# EAGLE design PlusShield (EAGLE 6.2)
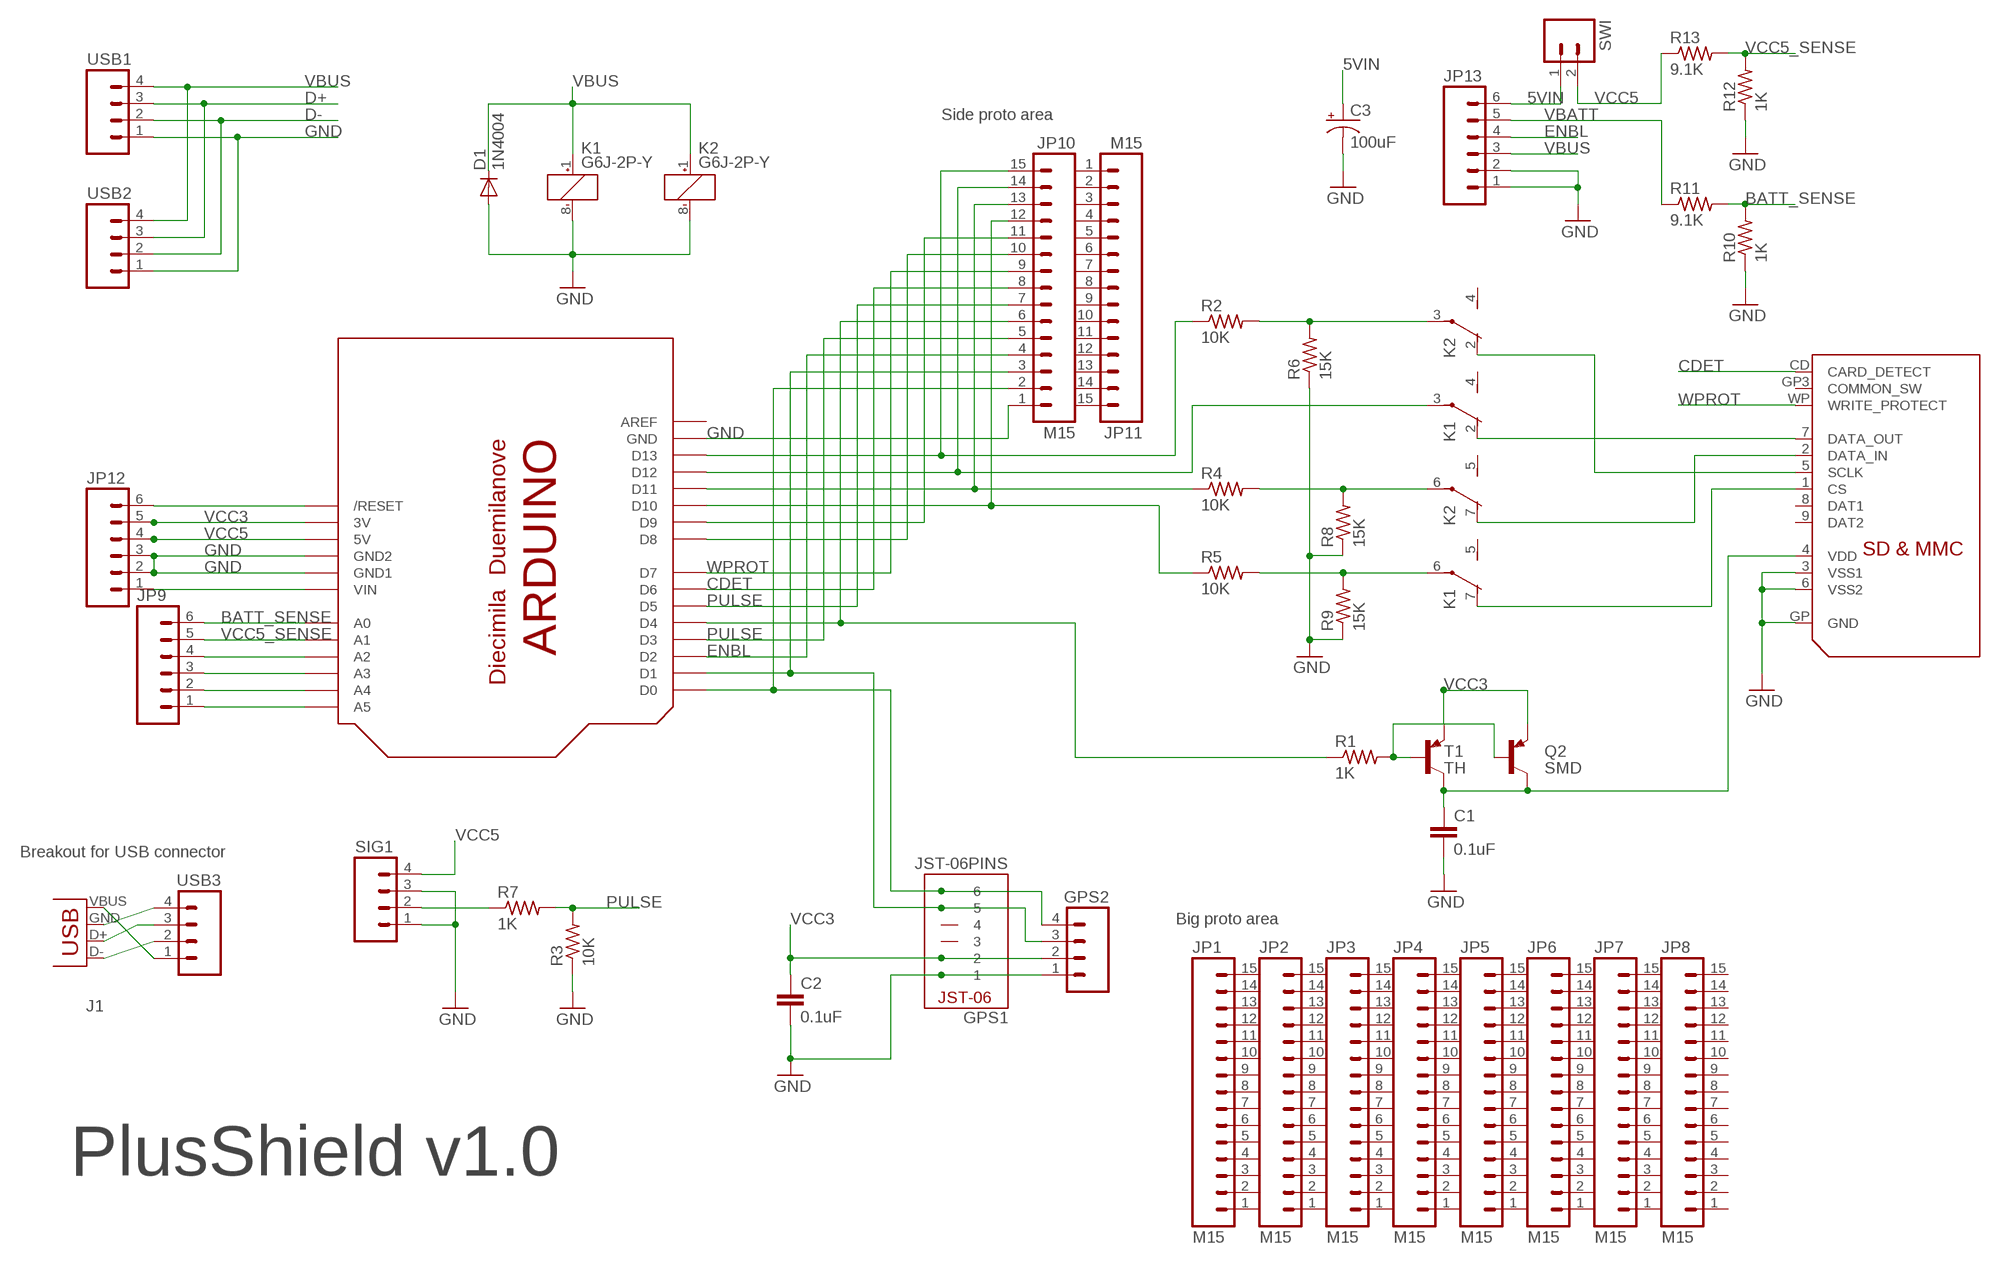
[diagram p0: schematic, sheet 1]

## Parts
C1  0.1uF  CAPPTH1  [CAP-PTH-5MM]
C2  0.1uF  CAPPTH1  [CAP-PTH-5MM]
C3  100uF  CAP_POL7343  [EIA7343]
D1  1N4004  [DO41-10]
GPS1  JST-06PINS  [JST-SM06B-SRSS-TB]
GPS2  M04PTH  [1X04]
J1  USB-A-DIP  [A-DIP]
JP1  M15  [1X15]
JP2  M15  [1X15]
JP3  M15  [1X15]
JP4  M15  [1X15]
JP5  M15  [1X15]
JP6  M15  [1X15]
JP7  M15  [1X15]
JP8  M15  [1X15]
JP9  M06SIP  [1X06]
JP10  M15  [1X15]
JP11  M15  [1X15]
JP12  M06SIP  [1X06]
JP13  M06SIP  [1X06]
K1  G6J-2P-Y  [G6J-2P-Y]
K2  G6J-2P-Y  [G6J-2P-Y]
Q2  SMD  MMBTA56-SOT23  [SOT23]
R1  1K  R-US_0207/10  [0207/10]
R2  10K  R-US_0207/10  [0207/10]
R3  10K  R-US_0207/10  [0207/10]
R4  10K  R-US_0207/10  [0207/10]
R5  10K  R-US_0207/10  [0207/10]
R6  15K  R-US_0207/10  [0207/10]
R7  1K  R-US_0207/10  [0207/10]
R8  15K  R-US_0207/10  [0207/10]
R9  15K  R-US_0207/10  [0207/10]
R10  1K  R-US_0207/10  [0207/10]
R11  9.1K  R-US_0207/10  [0207/10]
R12  1K  R-US_0207/10  [0207/10]
R13  9.1K  R-US_0207/10  [0207/10]
SIG1  M04PTH  [1X04]
SWI  M02PTH  [1X02]
T1  TH  MPSA56-TO92  [TO92-CBE]
U$1  SDMMC06132  [06132]
U$2  ARDUINOSHIELD-NOHOLE  [ARDUINO-NOHOLE]
USB1  M04PTH  [1X04]
USB2  M04PTH  [1X04]
USB3  M04PTH  [1X04]

## Nets
5VIN: C3.A(+) JP13.6 SWI.1
BATT_SENSE: JP9.6 R10.2 R11.2 U$2.A0
CDET: JP10.8 U$1.CD(CARD_DETECT) U$2.D6
D+: USB1.3 USB2.3
D+_C: J1.D+(D-) USB3.3
D-: USB1.2 USB2.2
D-_C: J1.D-(D+) USB3.2
ENBL: JP10.4 JP13.4 U$2.D2
GND: C1.2 C2.2 C3.C(-) D1.A GPS1.1 GPS2.1 JP10.1 JP12.2 JP12.3 JP13.1 JP13.2 K1.8(1:-) K2.8(1:-) R3.1 R6.1 R8.1 R9.1 R10.1 R12.1 SIG1.1 SIG1.3 U$1.3(VSS1) U$1.6(VSS2) U$1.GP(GND) U$2.GND U$2.GND1 U$2.GND2 USB1.1 USB2.1
GND_C: J1.GND(VBUS) USB3.4
N$1: JP10.6 R1.1 U$2.D4
N$2: Q2.1(B) R1.2 T1.B
N$3: JP10.15 R2.1 U$2.D13
N$4: JP10.11 U$2.D9
N$5: JP10.13 R4.1 U$2.D11
N$6: JP10.12 R5.1 U$2.D10
N$7: K2.2(2:O) U$1.5(SCLK)
N$8: K2.3(2:P) R2.2 R6.2
N$9: K2.7(3:O) U$1.2(DATA_IN)
N$10: K1.7(3:O) U$1.1(CS)
N$11: K1.2(2:O) U$1.7(DATA_OUT)
N$12: JP10.14 K1.3(2:P) U$2.D12
N$13: K2.6(3:P) R4.2 R8.2
N$14: K1.6(3:P) R5.2 R9.2
N$17: R7.1 SIG1.2
N$18: JP10.10 U$2.D8
N$19: JP12.1 U$2.VIN
N$20: JP12.6 U$2.RESET(/RESET)
N$21: JP9.1 U$2.A5
N$22: JP9.2 U$2.A4
N$23: JP9.3 U$2.A3
N$24: JP9.4 U$2.A2
PULSE: JP10.5 JP10.7 R3.2 R7.2 U$2.D3 U$2.D5
RX: GPS1.6 GPS2.4 JP10.2 U$2.D0
TX: GPS1.5 GPS2.3 JP10.3 U$2.D1
VBATT: JP13.5 R11.1
VBUS: D1.C JP13.3 K1.1(1:+) K2.1(1:+) USB1.4 USB2.4
VBUS_C: J1.VBUS(GND) USB3.1
VCC3: C2.1 GPS1.2 GPS2.2 JP12.5 Q2.2(E) T1.E U$2.3V
VCC5: JP12.4 R13.1 SIG1.4 SWI.2 U$2.5V
VCC5_SENSE: JP9.5 R12.2 R13.2 U$2.A1
VDD: C1.1 Q2.3(C) T1.C U$1.4(VDD)
WPROT: JP10.9 U$1.WP(WRITE_PROTECT) U$2.D7
Unconnected: GPS1.3 GPS1.4 JP1.1 JP1.2 JP1.3 JP1.4 JP1.5 JP1.6 JP1.7 JP1.8 JP1.9 JP1.10 JP1.11 JP1.12 JP1.13 JP1.14 JP1.15 JP2.1 JP2.2 JP2.3 JP2.4 JP2.5 JP2.6 JP2.7 JP2.8 JP2.9 JP2.10 JP2.11 JP2.12 JP2.13 JP2.14 JP2.15 JP3.1 JP3.2 JP3.3 JP3.4 JP3.5 JP3.6 JP3.7 JP3.8 JP3.9 JP3.10 JP3.11 JP3.12 JP3.13 JP3.14 JP3.15 JP4.1 JP4.2 JP4.3 JP4.4 JP4.5 JP4.6 JP4.7 JP4.8 JP4.9 JP4.10 JP4.11 JP4.12 JP4.13 JP4.14 JP4.15 JP5.1 JP5.2 JP5.3 JP5.4 JP5.5 JP5.6 JP5.7 JP5.8 JP5.9 JP5.10 JP5.11 JP5.12 JP5.13 JP5.14 JP5.15 JP6.1 JP6.2 JP6.3 JP6.4 JP6.5 JP6.6 JP6.7 JP6.8 JP6.9 JP6.10 JP6.11 JP6.12 JP6.13 JP6.14 JP6.15 JP7.1 JP7.2 JP7.3 JP7.4 JP7.5 JP7.6 JP7.7 JP7.8 JP7.9 JP7.10 JP7.11 JP7.12 JP7.13 JP7.14 JP7.15 JP8.1 JP8.2 JP8.3 JP8.4 JP8.5 JP8.6 JP8.7 JP8.8 JP8.9 JP8.10 JP8.11 JP8.12 JP8.13 JP8.14 JP8.15 JP11.1 JP11.2 JP11.3 JP11.4 JP11.5 JP11.6 JP11.7 JP11.8 JP11.9 JP11.10 JP11.11 JP11.12 JP11.13 JP11.14 JP11.15 K1.4(2:S) K1.5(3:S) K2.4(2:S) K2.5(3:S) U$1.8(DAT1) U$1.9(DAT2) U$1.GP3(COMMON_SW) U$2.AREF

## Notes on the sheet
- Side proto area
- Breakout for USB connector
- Big proto area
- PlusShield v1.0

## Library data of the parts
C1 C2 = SparkFun:CAP: Capacitor Standard 0603 ceramic capacitor, and 0.1" leaded capacitor.
C3 = SparkFun:CAP_POL: Capacitor Polarized These are standard SMD and PTH capacitors. Normally 10uF, 47uF, and 100uF in electrolytic and tantalum varieties. Always verify the external diameter of the through hole cap, it varies with capacity, voltage, and manufacturer. The EIA devices should be standard.
D1 = adafruit:1N4004: DIODE General purpose 1N400x type rectifier (With bigger pads) http://www.ladyada.net/library/pcb/eaglelibrary.html
GPS1 = Robin:JST-06PINS
GPS2 SIG1 USB1-USB3 = SparkFun:M04: Header 4 Standard 4-pin 0.1" header. Use with straight break away headers (SKU : PRT-00116), right angle break away headers (PRT-00553), swiss pins (PRT-00743), machine pins (PRT-00117), and female headers (PRT-00115). Molex polarized connector foot print use with SKU : PRT-08231 with associated crimp pins and housings.
J1 = SeeedConnector:USB: USB Connectors USB-B-PTH is fully proven SKU : PRT-00139 USB-miniB is fully proven SKU : PRT-00587 USB-A-PCB is untested. USB-A-H is throughly reviewed, but untested. Spark Fun Electronics SKU : PRT-00437 USB-B-SMT is throughly reviewed, but untested. Needs silkscreen touching up. USB-A-S has not been used/tested USB-MB-H has not been used/tested
JP1-JP8 JP10 JP11 = SparkFun:M15: Header 15 Standard 15-pin 0.1" header. Use with straight break away headers (SKU : PRT-00116), right angle break away headers (PRT-00553), swiss pins (PRT-00743), machine pins (PRT-00117), and female headers (PRT-00115).
JP9 JP12 JP13 = SparkFun:M06: Header 6 Standard 6-pin 0.1" header. Use with straight break away headers (SKU : PRT-00116), right angle break away headers (PRT-00553), swiss pins (PRT-00743), machine pins (PRT-00117), and female headers (PRT-00115). Molex polarized connector foot print use with SKU : PRT-08094 with associated crimp pins and housings. NOTES ON THE VARIANTS LOCK and LOCK_LONGPADS... This footprint was designed to help hold the alignment of a through-hole component (i.e. 6-pin header) while soldering it into place. You may notice that each hole has been shifted either up or down by 0.005 of an inch from it's more standard position (which is a perfectly straight line). This slight alteration caused the pins (the squares in the middle) to touch the edges of the holes. Because they are alternating, it causes a "brace" to hold the component in place. 0.005 has proven to be the perfect amount of "off-center" position when using our standard breakaway headers. Although looks a little odd when you look at the bare footprint, once you have a header in there, the alteration is very hard to notice. Also, if you push a header all the way into place, it is covered up entirely on the bottom side. This idea of altering the position of holes to aid alignment will be further integrated into the Sparkfun Library for other footprints. It can help hold any component with 3 or more connection pins.
K1 K2 = relay:G6J*-2?-Y: Surface-Mounting Signal Relay - G6J-Y 5.7 x 10.6 x 9 mm Source: http://www.omroncomponents.eu/ .. K125-E2-02-X.pdf; MF: OMRON COMPONENTS USA; MPN: G6J-2P-Y-DC12; OC_FARNELL: unknown; OC_NEWARK: 70J9830
Q2 T1 = transistor-pnp:*-?: PNP Transistor
R1-R13 = adafruit:R-US_: RESISTOR, American symbol
SWI = SparkFun:M02: Header 2 Standard 2-pin 0.1" header. Use with straight break away headers (SKU : PRT-00116), right angle break away headers (PRT-00553), swiss pins (PRT-00743), machine pins (PRT-00117), and female headers (PRT-00115). Molex polarized connector foot print use with SKU : PRT-08233 with associated crimp pins and housings.
U$1 = adafruit:SDMMC: SD MMC Card holder 4UCON part #06132 - easy to solder
U$2 = jam:ARDUINOSHIELD: Arduino Diecimila/Duemilanove Make a shield with ease, this package has all the named pins as well as the two mounting drill holes and an outline of the USB and DC power connector. The outline is on the DIMENSION layer, so if your board house uses it they will cut the outline to match. http://www.ladyada.net/library/pcb/eaglelibrary.html

## Board
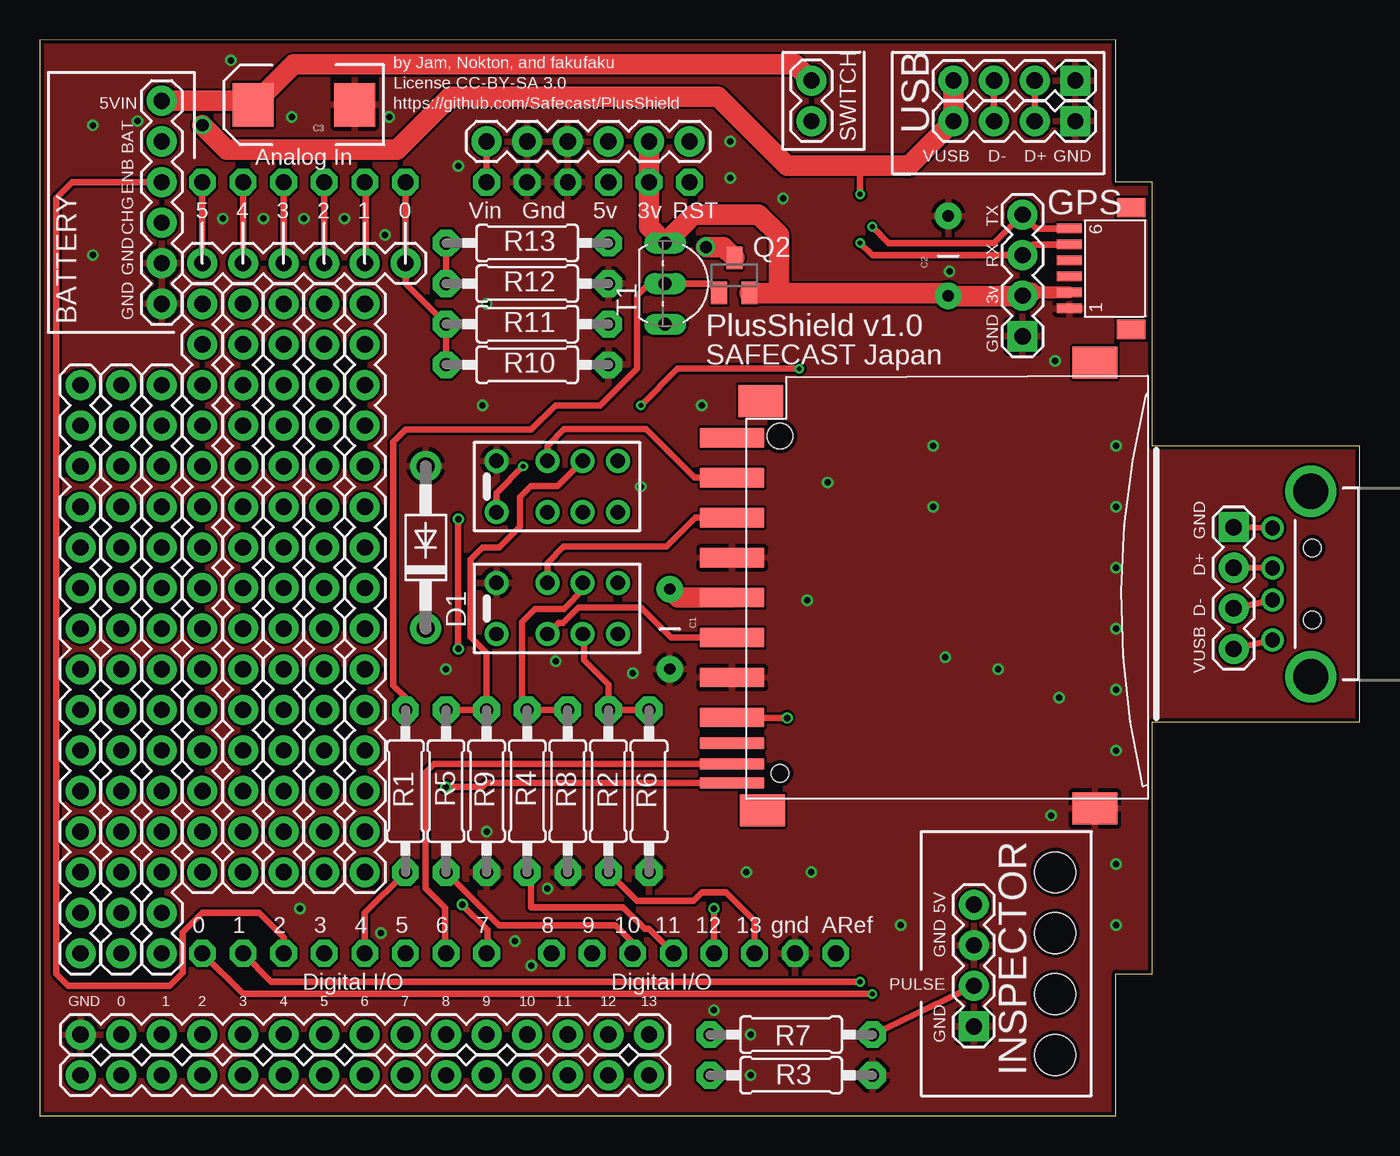
[diagram p1: board, top side]
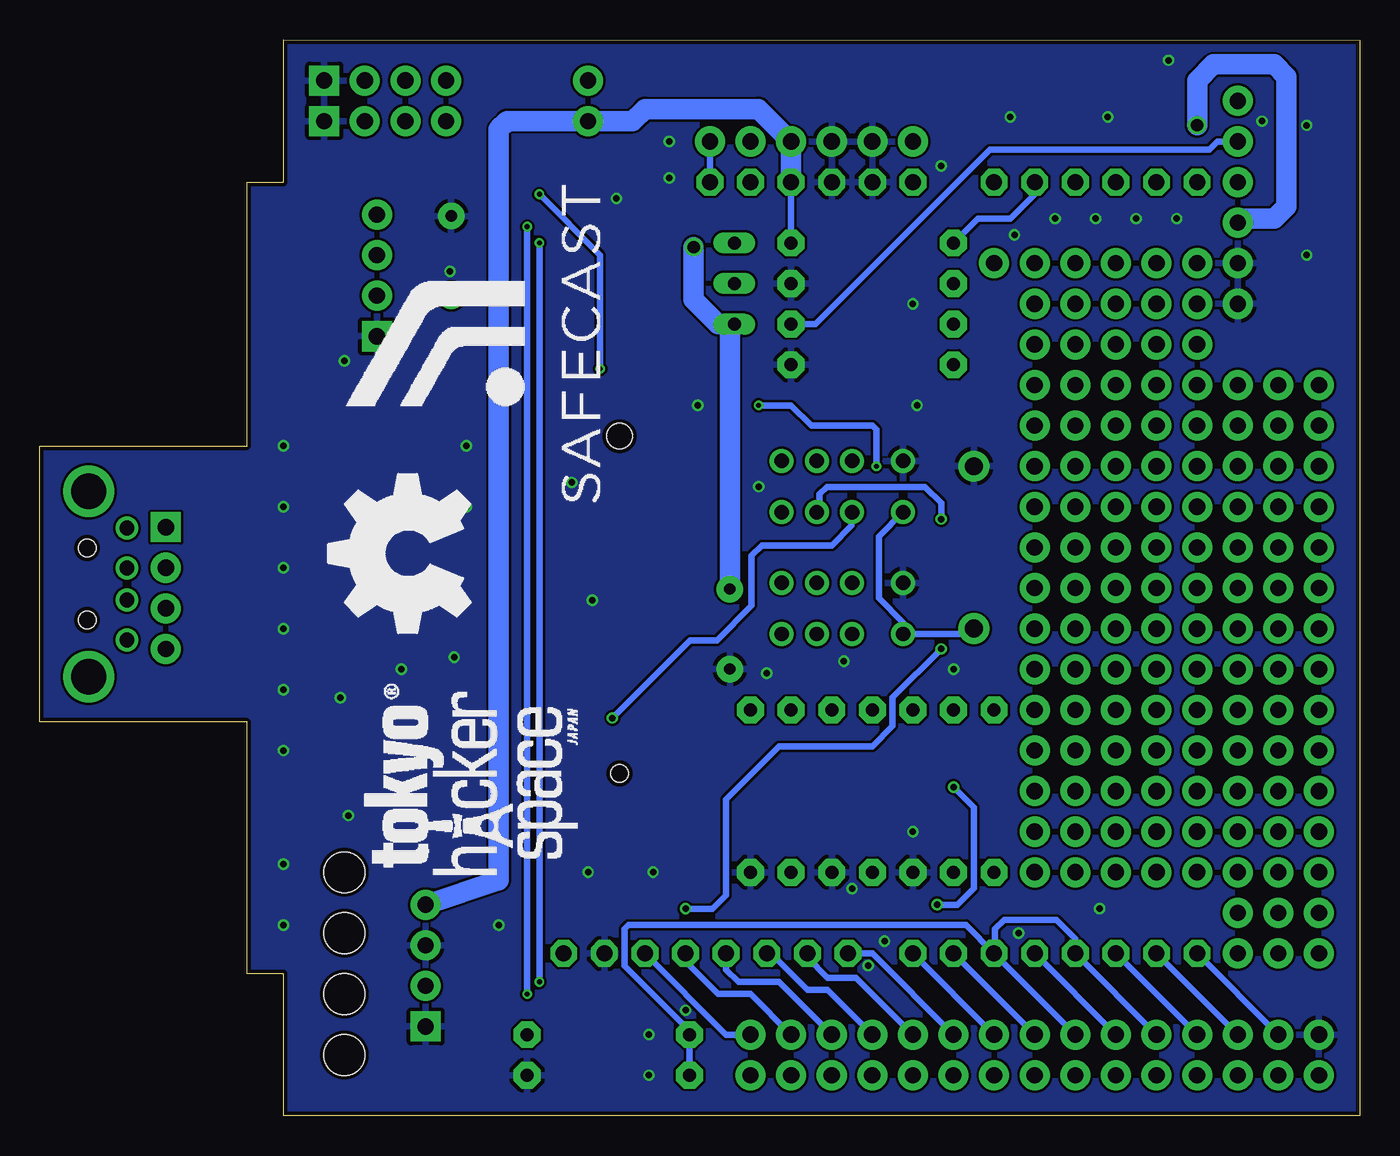
[diagram p2: board, bottom side, seen from below]

Size 82.55 x 67.31 mm. Coordinates in mm from the lower left corner, seen from the top.
Outline: 0,0 67.31,0 67.31,8.89 69.6,8.89 69.6,24.64 82.55,24.64 82.55,41.91 69.6,41.91 69.6,58.42 67.31,58.41 67.31,67.31 0,67.3 0,0
Copper layers (1*16): Top 0.035mm / dielectric 1.5mm / Bottom 0.035mm
Design rules: minimum track width 6mil, minimum drill 12mil, track to track 6mil, track to pad 6mil, pad to pad 6mil, via to via 6mil, smd to smd 0mil, copper to edge 10mil, drill to drill 10mil, minimum pad ring 10mil, minimum via ring 6mil, stop-mask expansion 2mil, vias tented up to drill 100mil, thermal gap 10mil
Holes 2.54 mm at 63.5,15.24 63.5,11.43 63.5,7.62 63.5,3.81

### Footprints (pad centres in the part's own frame; a part is rotated, then mirrored left to right if it is on the bottom)
CAP-PTH-5MM = drill 0.7 pad 1.651: 1 -2.5,0; 2 2.5,0
EIA7343 = smd 2.55 x 2.7: A 3.17,0; C -3.17,0
DO41-10 = drill 1.118 pad 1.93: A 5.08,0; C -5.08,0
JST-SM06B-SRSS-TB = smd 0.6 x 1.55: 1 -5.7,4.775; 2 -4.7,4.775; 3 -3.7,4.775; 4 -2.7,4.775; 5 -1.7,4.775; 6 -0.7,4.775 | smd 1.2 x 1.8: NC -7,0.9; NC@1 0.6,0.9
1X04 = drill 1.016 pad 1.88 square: 1 0,0 | drill 1.016 pad 1.88: 2 2.54,0; 3 5.08,0; 4 7.62,0
A-DIP = drill 0.914: D+ 2.4,1; D- 2.4,-1; GND 2.4,3.5; VBUS 2.4,-3.5 | drill 2.2: GND@1 0,5.8; GND@2 0,-5.8 | hole 1.1: -0.1,2.25; -0.1,-2.25
1X15 = drill 1.016 pad 1.88: 1 0,0; 2 2.54,0; 3 5.08,0; 4 7.62,0; 5 10.16,0; 6 12.7,0; 7 15.24,0; 8 17.78,0; 9 20.32,0; 10 22.86,0; 11 25.4,0; 12 27.94,0; 13 30.48,0; 14 33.02,0; 15 35.56,0
1X06 = drill 1.016 pad 1.88: 1 0,0; 2 2.54,0; 3 5.08,0; 4 7.62,0; 5 10.16,0; 6 12.7,0
G6J-2P-Y = drill 0.9 pad 1.5: 1 -3.2,-1.6; 2 0,-1.6; 3 2.2,-1.6; 4 4.4,-1.6; 5 4.4,1.6; 6 2.2,1.6; 7 0,1.6; 8 -3.2,1.6
SOT23 = smd 1 x 1.4: 1 -0.95,-1.1; 2 0.95,-1.1; 3 0,1.1
0207/10 = drill 0.813 pad 1.676 octagon: 1 -5.08,0; 2 5.08,0
1X02 = drill 1.016 pad 1.88: 1 0,0; 2 2.54,0
TO92-CBE = drill 0.813 long: B 0,0; C 2.54,0; E -2.54,0
06132 = smd 1.2 x 4: 1 6.9,0.9; 2 4.4,0.9; 3 1.9,0.9; 4 -0.6,0.9; 5 -3.1,0.9; 6 -5.6,0.9; 7 -8.1,0.9; 9 9.4,0.9 | smd 0.7 x 4: 8 -9.7,0.9; CD -11,0.9; WP -12.2,0.9 | smd 2 x 2.8: GP -13.8,-21.8; GP2 14.1,-21.8; GP3 11.7,-0.9; GP4 -13.9,-1 | hole 1.1: -11.6,-2.1 | hole 1.6: 9.5,-2.1
ARDUINO-NOHOLE = drill 1 pad 1.676 octagon: 3V 35.56,2.54; 5V 38.1,2.54; A0 50.8,2.54; A1 53.34,2.54; A2 55.88,2.54; A3 58.42,2.54; A4 60.96,2.54; A5 63.5,2.54; AREF 23.876,50.8; D0 63.5,50.8; D1 60.96,50.8; D2 58.42,50.8; D3 55.88,50.8; D4 53.34,50.8; D5 50.8,50.8; D6 48.26,50.8; D7 45.72,50.8; D8 41.656,50.8; D9 39.116,50.8; D10 36.576,50.8; D11 34.036,50.8; D12 31.496,50.8; D13 28.956,50.8; GND 26.416,50.8; GND1 43.18,2.54; GND2 40.64,2.54; RESET 33.02,2.54; VIN 45.72,2.54

### Placement (x,y rotation side)
C1  39.4,30.45 270 top
C2  56.82,53.8 90 top
C3  16.51,63.25 180 top
D1  24.13,35.56 90 top
GPS1  69.16,56.21 90 top
GPS2  61.47,48.77 90 top
J1  79.5,33.27 180 top
JP1  2.54,10.16 90 top
JP2  5.08,10.16 90 top
JP3  7.62,10.16 90 top
JP4  10.16,15.24 90 top
JP5  12.7,15.24 90 top
JP6  15.24,15.24 90 top
JP7  17.78,15.24 90 top
JP8  20.32,15.24 90 top
JP9  10.16,53.34 0 top
JP10  2.54,5.08 0 top
JP11  2.54,2.54 0 top
JP12  27.94,60.96 0 top
JP13  7.62,50.8 90 top
K1  31.75,39.37 0 top
K2  31.75,31.75 0 top
Q2  43.43,52.58 0 top
R1  22.86,20.32 90 top
R2  35.56,20.32 90 top
R3  46.99,2.54 180 top
R4  30.48,20.32 90 top
R5  25.4,20.32 90 top
R6  38.1,20.32 90 top
R7  46.99,5.08 180 top
R8  33.02,20.32 90 top
R9  27.94,20.32 90 top
R10  30.48,46.99 180 top
R11  30.48,49.53 180 top
R12  30.48,52.07 180 top
R13  30.48,54.61 180 top
SIG1  58.42,5.59 90 top
SWI  48.26,64.77 270 top
T1  39.12,52.07 270 top
U$1  44.2,33.02 90 top
U$2  73.66,60.96 180 top
U$4  [SAFECAST_LOGO]  46.23,37.85 90 bottom
U$6  [THS]  45.97,11.18 90 bottom
U$7  [OSHW_FILLX350_NOTEXT]  55.63,30.23 90 bottom
USB1  64.77,62.23 180 top
USB2  64.77,64.77 180 top
USB3  74.68,36.83 270 top

### Tracks (layer width: path | path; a pad name or v marks a point on that pad's centre or on a via)
5VIN
  Top 1.27: JP13.6 13.09,63.5 C3.A 15.88,65.79 47.24,65.79 SWI.1
BATT_SENSE
  Top 0.406: R10.2 R11.2 22.86,52.07 JP9.6 U$2.A0
CDET
  Top 0.406: U$2.D6 25.35,10.21 25.35,13.01 24.13,14.22 24.13,21.49 24.66,22.02 U$1.CD
  Bottom 0.406: JP10.8 U$2.D6
D+
  Top 0.406: USB2.3 USB1.3
D+_C
  Top 0.406: USB3.3 J1.D+
D-
  Top 0.406: USB2.2 USB1.2
D-_C
  Top 0.406: USB3.2 J1.D-
ENBL
  Top 0.406: U$2.D2 15.24,11.18 13.72,12.7 10.16,12.7 8.94,11.48 8.94,8.94 8.13,8.13 1.78,8.13 1.02,8.89 1.02,57.4 2.03,58.42 JP13.4
  Bottom 0.406: JP10.4 U$2.D2
GND  (via drill 0.41)
  other vias: 15.75,62.48 3.3,61.98 3.3,53.85 49.28,39.62 29.72,10.92 31.75,14.22 26.16,59.44 43.18,58.67 44.2,15.24 48.26,15.24 53.85,11.94 21.34,11.43 25.4,27.94 32.26,28.45 67.31,15.75 37.08,27.69 37.59,39.37 63.75,26.16 56.64,28.7 59.94,27.94 55.88,38.1 67.31,22.86 67.31,26.67 67.31,30.48 67.31,34.29 67.31,38.1 55.88,41.91 67.31,41.91 46.48,57.4 63.5,47.24 11.43,56.13 43.18,60.96 27.94,50.8 67.31,11.94 44.45,5.08 41.4,44.45 44.45,2.54 27.69,44.45 16.26,12.95 48.01,32.26 27.94,17.78 63.25,18.8 56.9,52.83 13.97,56.13 16.51,56.13 19.05,56.13 21.59,55.12 6.1,62.23 42.16,6.6 30.73,9.4 21.84,62.48 11.94,66.04
  pour Bottom: -5.08,68.58 85.09,68.58 85.09,-1.27 -5.08,-1.27
  pour Top: 96.77,68.73 96.77,-0.81 -5.61,-0.81 -5.61,68.73
GND_C
  Top 0.406: USB3.4 J1.GND
N$1
  Top 0.406: U$2.D4 20.32,12.7 R1.1
  Bottom 0.406: JP10.6 U$2.D4 | 22.86,14.73 R1.1
N$2
  Top 0.406: R1.2 22.86,26.16 22.1,26.92 22.1,42.16 22.86,42.93 30.73,42.93 32.26,44.45 35.05,44.45 37.34,46.74 37.34,51.31 38.1,52.07 T1.B 41.89,52.07 Q2.1
N$3
  Top 0.406: R2.1 37.34,13.46 40.89,13.46 41.4,13.97 42.93,13.97 44.7,12.19 U$2.D13
  Bottom 0.406: JP10.15 39.62,5.08 U$2.D13
N$4
  Bottom 0.406: JP10.11 31.5,8.64 33.27,8.64 34.54,9.91 U$2.D9
N$5
  Top 0.406: R4.1 30.73,14.99 30.73,13.06 36.47,13.06 37.85,11.68 38.1,11.68 U$2.D11
  Bottom 0.406: JP10.13 36.32,8.38 38.86,8.38 39.62,9.14 U$2.D11
N$6
  Top 0.406: U$2.D10 37.08,10.85 36.02,11.91 28.73,11.91 R5.1 25.35,15.19
  Bottom 0.406: JP10.12 33.27,7.87 34.54,7.87 36.83,10.16 U$2.D10
N$7
  Top 0.406: U$1.5 39.47,29.92 37.59,31.8 33.68,31.8 32.72,30.84 32.44,30.84 K2.2
N$8
  Top 0.406: R6.2 R2.2 35.56,27 34.04,28.52 34.04,30.06 K2.3
N$9
  Top 0.406: K2.7 31.75,34.59 32.77,35.61 39.19,35.61 41,37.42 U$1.2
N$10
  Top 0.406: K1.7 31.75,41.91 32.79,42.95 37.92,42.95 40.95,39.92 U$1.1 44.66,40.08
N$11  (via drill 0.41)
  Top 0.406: U$1.7 43.32,24.89 v46.74,24.89
  Bottom 0.406: K1.2 31.77,37.74 31.77,36.93 33.02,35.69 37.39,35.69 38.02,35.05 38.02,31.93 40.21,29.74 41.88,29.74 v46.74,24.89
N$12  (via drill 0.41)
  Top 0.406: U$2.D12 v42.16,12.95 | v26.16,29.21 v26.16,37.34
  Bottom 0.406: K1.3 33.78,37.94 33.78,38.89 33.33,39.34 27.18,39.34 26.16,38.33 v26.16,37.34 | JP10.14 38.1,7.62 40.13,7.62 42.16,9.65 U$2.D12 | v42.16,12.95 40.46,12.95 39.62,13.79 39.62,19.81 36.32,23.11 30.48,23.11 29.21,24.38 29.21,26.16 v26.16,29.21
N$13
  Top 0.406: R8.2 R4.2 30.15,25.73 30.15,30.91 30.96,31.73 32.79,31.73 33.95,32.88 K2.6
N$14
  Top 0.406: R5.2 R9.2 27.94,28.96 26.92,29.97 26.92,34.8 27.69,35.56 28.73,35.56 30.05,36.88 30.05,38.71 30.73,39.4 32.38,39.4 K1.6
N$17
  Top 0.406: R7.1 SIG1.2
N$18
  Bottom 0.406: JP10.10 30.48,10.16 U$2.D8
N$19
  Top 0.406: U$2.VIN JP12.1
N$20
  Bottom 0.406: U$2.RESET JP12.6
N$21
  Top 0.406: U$2.A5 JP9.1
N$22
  Top 0.406: U$2.A4 JP9.2
N$23
  Top 0.406: U$2.A3 JP9.3
N$24
  Top 0.406: U$2.A2 JP9.4
PULSE
  Bottom 0.406: U$2.D5 22.81,10.21 22.81,11.68 22.23,12.27 18.97,12.27 17.78,11.07 U$2.D3 JP10.5 | R3.2 R7.2 41.91,5.33 45.97,9.4 45.97,11.68 45.72,11.94 24.64,11.94 U$2.D5 | JP10.7 U$2.D5
RX  (via drill 0.3)
  Top 0.406: U$2.D0 12.7,7.62 v52.07,7.62 | 64.27,55.63 GPS1.6 62.35,55.51 GPS2.4 59.69,54.61 53.09,54.61 v52.07,55.63
  Bottom 0.406: JP10.2 U$2.D0 | v52.07,7.62 v52.07,55.63
TX  (via drill 0.3)
  Top 0.406: U$2.D1 14.48,8.38 v51.31,8.38 | 64.29,54.61 GPS1.5 62.13,54.51 GPS2.3 52.07,53.85 v51.31,54.61
  Bottom 0.406: JP10.3 U$2.D1 | v51.31,8.38 v51.31,54.61
VBATT
  Bottom 0.406: R11.1 34.04,49.53 23.11,60.45 9.4,60.45 8.89,60.96 JP13.5
VBUS  (via drill 0.3, 0.76)
  Top 0.406: USB1.4 56.9,61.98 | v30.23,40.64 28.55,38.96 K1.1 | v37.59,44.45 39.88,46.74 v47.5,46.74 | v51.31,57.66 51.31,59.18 51.56,59.44
  Top 1.27: USB2.4 USB1.4 54.36,59.44 51.56,59.44 46.74,59.44 42.42,63.75 25.65,63.75 22.35,60.45 11.68,60.45 v10.16,61.98
  Bottom 0.406: K1.1 30.07,36.25 30.07,32.38 28.55,30.86 K2.1 24.46,30.15 D1.C | v30.23,40.64 30.23,42.93 30.48,43.18 34.29,43.18 35.56,44.45 v37.59,44.45 | v47.5,46.74 47.5,53.85 v51.31,57.66
  Bottom 1.27: v10.16,61.98 10.16,64.77 9.14,65.79 5.33,65.79 4.57,65.02 4.57,56.9 5.33,56.13 7.37,56.13 JP13.3
VBUS_C
  Top 0.406: USB3.1 J1.VBUS
VCC3
  Top 0.762: GPS1.2 61.98,51.51 61.47,51.51 GPS2.2
  Top 1.27: JP12.5 U$2.3V 38.1,55.63 T1.E 40.89,56.39 44.96,56.39 46.23,55.12 46.23,51.48 | 61.47,51.3 GPS2.2 | 46.23,51.48 56.64,51.48 C2.1 61.76,51.3 61.98,51.51 | Q2.2 46.23,51.48
VCC5
  Bottom 0.406: R13.1 U$2.5V
  Bottom 1.27: U$2.5V JP12.4 37.59,62.99 44.7,62.99 45.47,62.23 SWI.2 53.34,62.23 53.85,61.72 53.85,14.73 SIG1.4
VCC5_SENSE
  Top 0.406: U$2.A1 20.37,58.37 20.37,53.39 JP9.5 | R12.2 R13.2
  Bottom 0.406: R13.2 23.88,56.13 21.84,56.13 20.32,57.66 U$2.A1
VDD  (via drill 0.76)
  Top 1.27: C1.1 39.93,32.42 U$1.4 | v41.66,54.36 42.76,54.36 Q2.3
  Bottom 1.27: C1.1 39.4,49.25 T1.C 40.13,49.53 41.66,51.05 v41.66,54.36
WPROT  (via drill 0.41)
  Top 0.406: U$2.D7 27.99,10.21 27.99,11.63 v26.42,13.21 | U$1.WP 27.94,20.82 27.69,20.57 v25.4,20.57
  Bottom 0.406: JP10.9 U$2.D7 | v26.42,13.21 25.15,13.21 24.13,14.22 24.13,19.3 v25.4,20.57

### Text on the board
tPlace: by Jam, Nokton, and fakufaku | 5VIN | License CC-BY-SA 3.0 | https://github.com/Safecast/PlusShield | SWITCH | USB | BAT | VUSB | D- | D+ | GND | ENB | TX | GPS | CHG | GND | RX | 3v | BATTERY | GND | PlusShield v1.0 | GND | SAFECAST Japan | GND | D+ | D- | VUSB | 5V | GND | PULSE | GND | 0 | 1 | 2 | 3 | 4 | 5 | 6 | 7 | 8 | 9 | 10 | 11 | 12 | 13 | GND | INSPECTOR